# Altium project DAU_Kupplung_3phasig_V1_13.PrjPcb
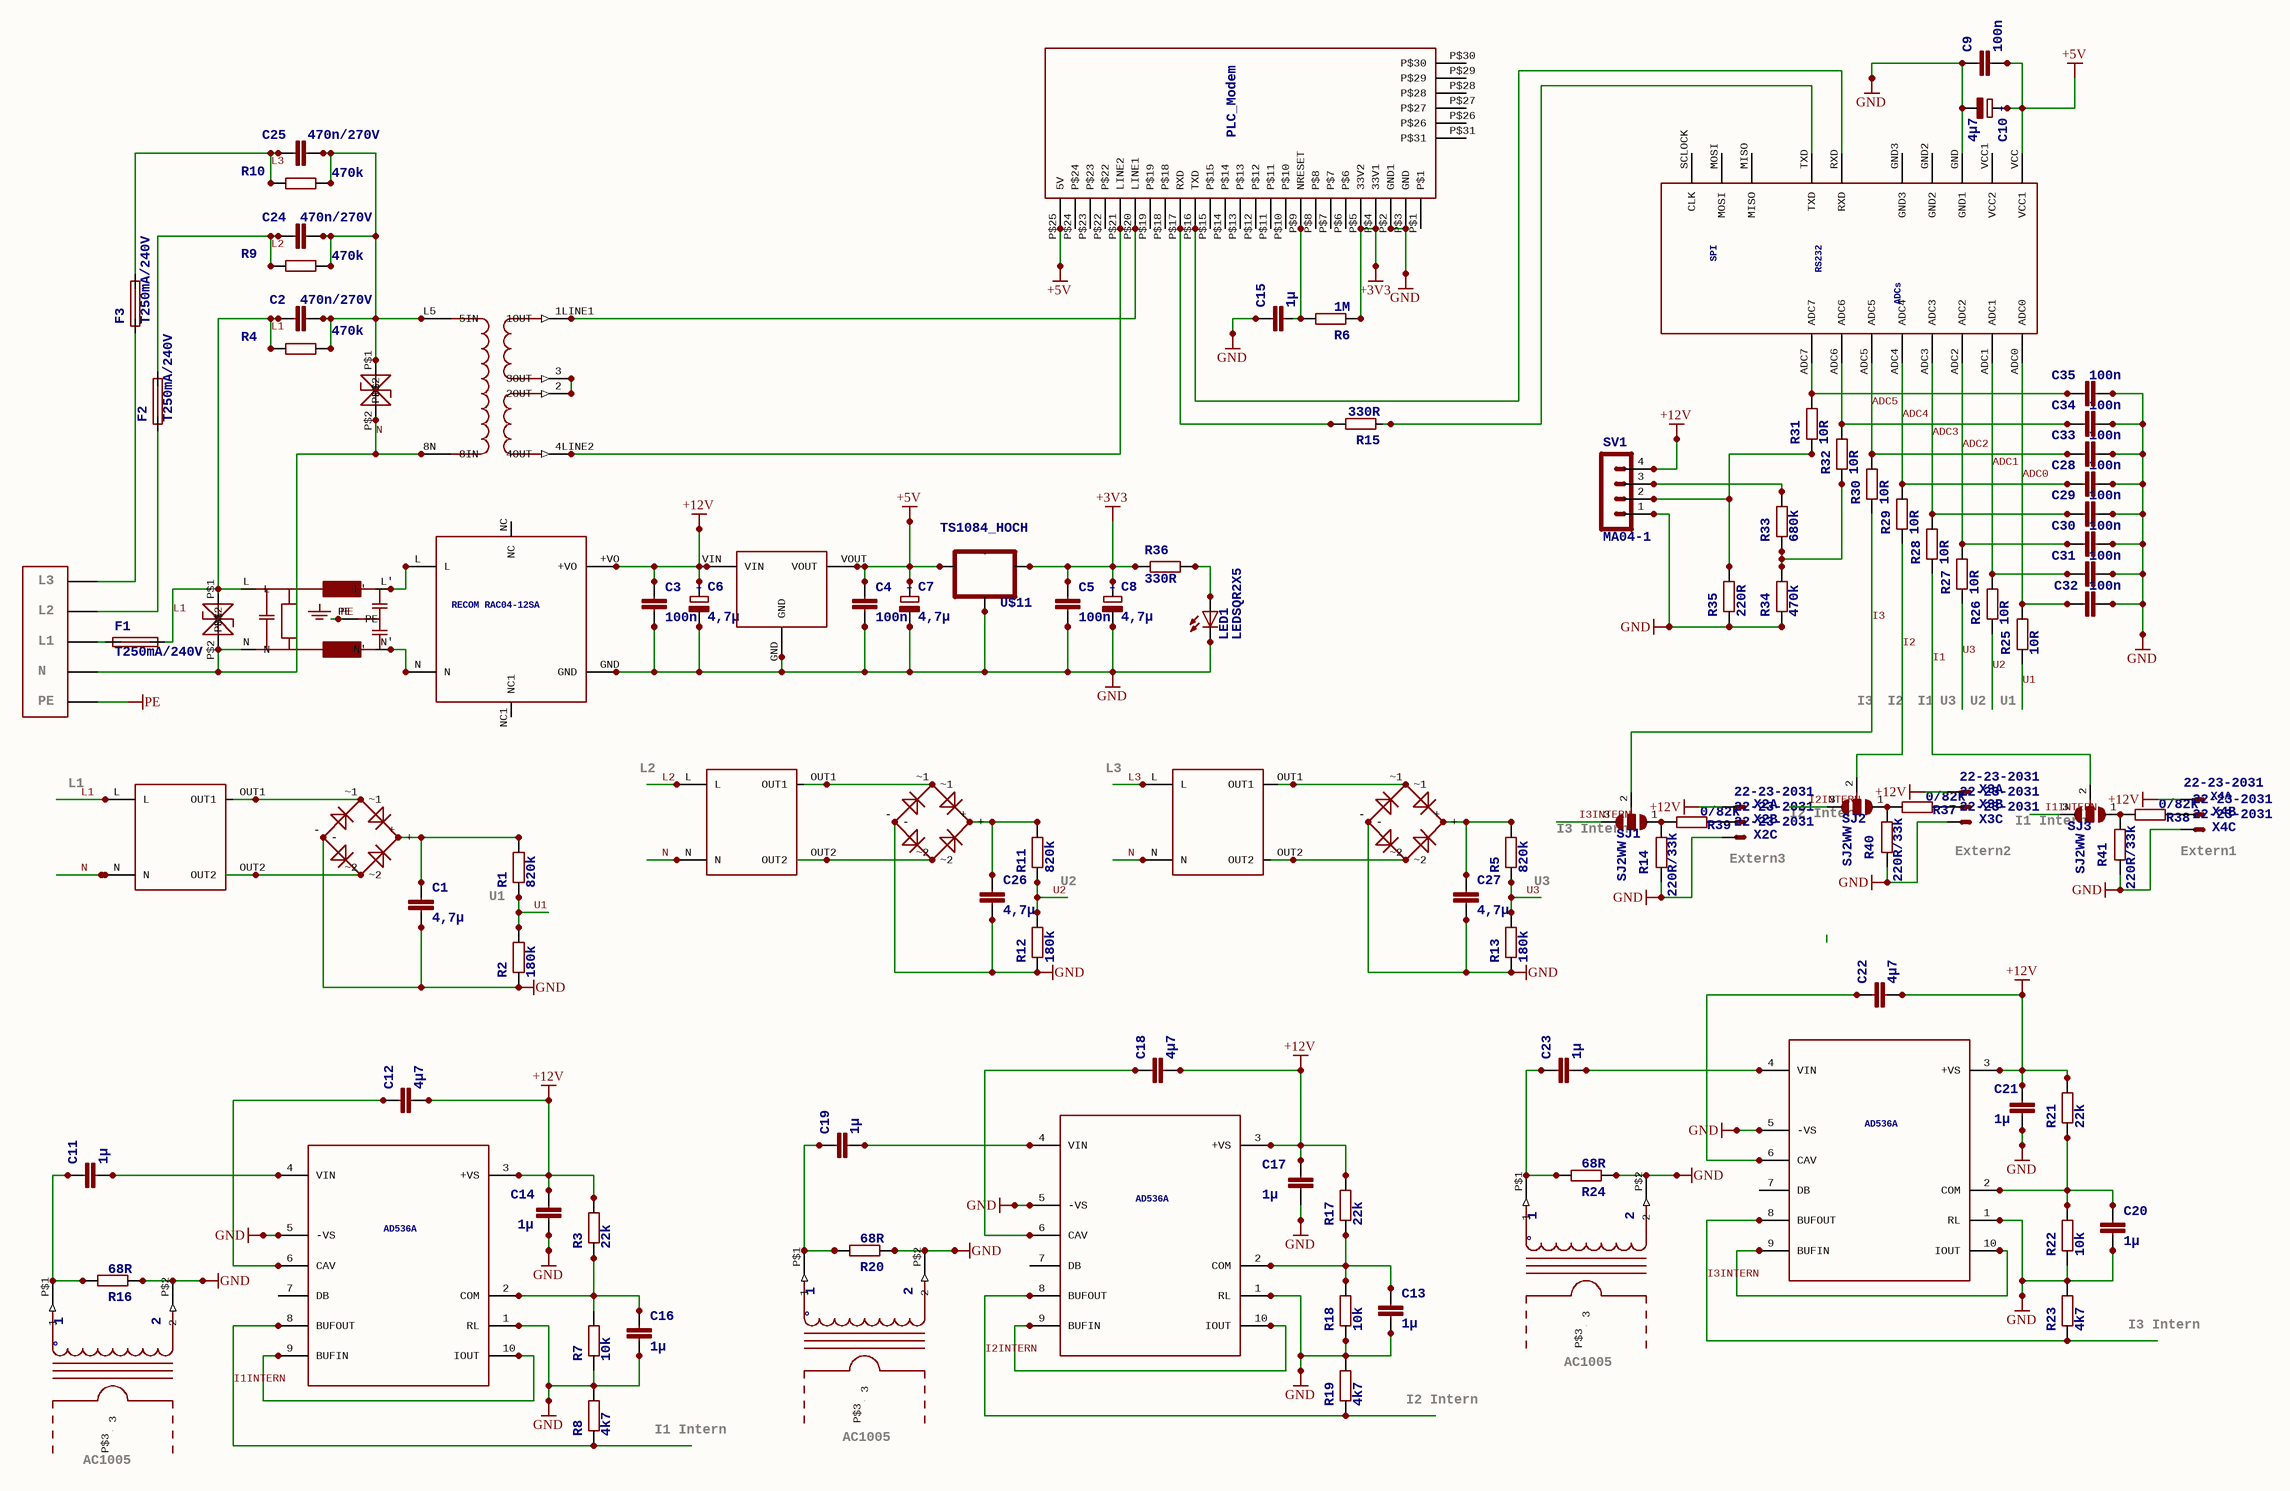
[diagram p0: DAU_Kupplung_3phasig_V1_13.SchDoc]
1 sheet, 109 parts. Net scope: global (net labels, ports and power ports of the same name join across sheets).
Board file: DAU_Kupplung_3phasig_V1_13.PcbDoc

## Sheet DAU_Kupplung_3phasig_V1_13.SchDoc: DAU_Kupplung_3phasig_V1_13.sch
size 410 x 293 mm; Date: 19.11.2014 09:24:20; DocumentNumber: Document Number:; Revision: REV:; SheetNumber: 1

### Parts
AC1002_1  AC1010  [AC1010]  (value not drawn)
C1  4,7µ  [C1206]
C2  470n/270V  [C225-087X268]
C3  100n  [C0805K]
C4  100n  [C0805K]
C5  100n  [C0805K]
C6  4,7µ  [E2,5-6]
C7  4,7µ  [E2,5-6]
C8  4,7µ  [E2,5-6]
C9  100n  [C0805K]
C10  4µ7  [E2,5-6E]
C11  1µ  [C0805K]
C12  4µ7  [C0805K]
C13  1µ  [C0805K]
C14  1µ  [C0805K]
C15  1µ  [C0805K]
C16  1µ  [C0805K]
C17  1µ  [C0805K]
C18  4µ7  [C0805K]
C19  1µ  [C0805K]
C20  1µ  [C0805K]
C21  1µ  [C0805K]
C22  4µ7  [C0805K]
C23  1µ  [C0805K]
C24  470n/270V  [C225-087X268]
C25  470n/270V  [C225-087X268]
C26  4,7µ  [C1206]
C27  4,7µ  [C1206]
C28  100n  [C0805K]
C29  100n  [C0805K]
C30  100n  [C0805K]
C31  100n  [C0805K]
C32  100n  [C0805K]
C33  100n  [C0805K]
C34  100n  [C0805K]
C35  100n  [C0805K]
F1  T250mA/240V  [TR5]
F2  T250mA/240V  [TR5]
F3  T250mA/240V  [TR5]
LED1  LEDSQR2X5  [LED2X5]
P6KE300CA  P6KE300CA  [TSV]  (value not drawn)
R1  820k  [R0805]
R2  180k  [R0805]
R3  22k  [R0805]
R4  470k  [0204/7]
R5  820k  [R0805]
R6  1M  [R0805]
R7  10k  [R0805]
R8  4k7  [R0805]
R9  470k  [0204/7]
R10  470k  [0204/7]
R11  820k  [R0805]
R12  180k  [R0805]
R13  180k  [R0805]
R14  220R/33k  [R0805]
R15  330R  [R0805]
R16  68R  [0204/7]
R17  22k  [R0805]
R18  10k  [R0805]
R19  4k7  [R0805]
R20  68R  [0204/7]
R21  22k  [R0805]
R22  10k  [R0805]
R23  4k7  [R0805]
R24  68R  [0204/7]
R25  10R  [R0805]
R26  10R  [R0805]
R27  10R  [R0805]
R28  10R  [R0805]
R29  10R  [R0805]
R30  10R  [R0805]
R31  10R  [R0805]
R32  10R  [R0805]
R33  680k  [R0805]
R34  470k  [R0805]
R35  220R  [R0805]
R36  330R  [R0805]
R37  0/82k  [R0805]
R38  0/82k  [R0805]
R39  0/82k  [R0805]
R40  220R/33k  [R0805]
R41  220R/33k  [R0805]
SJ1  SJ2WW  [SJ_2W]
SJ2  SJ2WW  [SJ_2W]
SJ3  SJ2WW  [SJ_2W]
SV1  MA04-1  [MA04-1]
TSV2  TSV  [TSV]  (value not drawn)
U$1  RECOM_RAC04_12SA  [RAC04_12SA]  (value not drawn)
U$2  SICHERHEITSTRAFO  [TRAFO_0,35VA]  (value not drawn)
U$3  ADUC831_MINIMUM  [ADUC_MINIMUM]  (value not drawn)
U$4  MODEMSTECKER  [MODEM_FUSS]  (value not drawn)
U$5  PLC_UEBERTRAGER_V2  [PLC-UEBERTRAGER_V2]  (value not drawn)
U$7  AC1010  [AC1010]  (value not drawn)
U$8  RECTIFIER  [RECTIFIER]  (value not drawn)
U$10  RECOM_785_05  [RECOM785X]  (value not drawn)
U$11  TS1084_HOCH  [TS1084_HOCH]
U$12  AD536  [TO100_10PIN]  (value not drawn)
U$13  AD536  [TO100_10PIN]  (value not drawn)
U$14  AC1010  [AC1010]  (value not drawn)
U$15  AD536  [TO100_10PIN]  (value not drawn)
U$16  SICHERHEITSTRAFO  [TRAFO_0,35VA]  (value not drawn)
U$17  RECTIFIER  [RECTIFIER]  (value not drawn)
U$18  SICHERHEITSTRAFO  [TRAFO_0,35VA]  (value not drawn)
U$19  RECTIFIER  [RECTIFIER]  (value not drawn)
U$20  NETZFILTER_05_A  [NETZFILTER]  (value not drawn)
X1  CONNECTO_5_POL  [CONNECTOR_5_POL]  (value not drawn)
X2  22-23-2031  [22-23-2031]  (parts A,B,C of 3)
X3  22-23-2031  [22-23-2031]  (parts A,B,C of 3)
X4  22-23-2031  [22-23-2031]  (parts A,B,C of 3)

### Nets
+3V3: C5.1 C8.+ R6.1 R36.1 U$4.P$4(33V1) U$4.P$5(33V2) U$11.OUT
+5V: C4.1 C7.+ C9.2 C10.+ U$3.VCC(VCC1) U$4.P$25(5V) U$10.VOUT U$11.IN
+12V: C3.1 C6.+ C12.2 C14.2 C17.2 C18.2 C21.1 C22.2 R3.2 R17.2 R21.2 SV1.4 U$1.+VO U$10.VIN U$12.3(+VS) U$13.3(+VS) U$15.3(+VS) X2.1(S) X3.1(S) X4.1(S)
GND: AC1002_1.P$2(2) C1.2 C3.2 C4.2 C5.2 C6.- C7.- C8.- C9.1 C10.- C13.2 C14.1 C15.1 C16.2 C17.1 C20.2 C21.2 C26.2 C27.2 C28.2 C29.2 C30.2 C31.2 C32.2 C33.2 C34.2 C35.2 LED1.K(C) R2.1 R7.1 R8.2 R12.1 R13.1 R14.1 R16.1 R18.1 R19.2 R20.1 R22.1 R23.2 R24.1 R34.1 R35.1 R40.1 R41.1 SV1.1 U$1.GND U$3.GND(GND1) U$4.P$2(GND1) U$4.P$3(GND) U$7.P$2(2) U$8.- U$10.GND U$11.GND U$12.1(RL) U$12.5(-VS) U$13.1(RL) U$13.5(-VS) U$14.P$2(2) U$15.1(RL) U$15.5(-VS) U$17.- U$19.- X2.3(S) X3.3(S) X4.3(S)
PE: U$20.PE X1.P$5
ADC0: C32.1 R25.2 U$3.ADC0
ADC1: C31.1 R26.2 U$3.ADC1
ADC2: C30.1 R27.2 U$3.ADC2
ADC3: C29.1 R28.2 U$3.ADC3
ADC4: C28.1 R29.2 U$3.ADC4
ADC5: C33.1 R30.2 U$3.ADC5
I1: R28.1 SJ3.2
I1INTERN: R8.1 SJ3.3 U$13.8(BUFOUT)
I2: R29.1 SJ2.2
I2INTERN: R19.1 SJ2.3 U$12.8(BUFOUT)
I3: R30.1 SJ1.2
I3INTERN: R23.1 SJ1.3 U$15.8(BUFOUT)
L1: C2.1 F1.2 P6KE300CA.P$1 R4.2 U$2.L U$20.L
L2: C24.1 F2.2 R9.2 U$16.L
L3: C25.1 F3.2 R10.2 U$18.L
N: P6KE300CA.P$2 TSV2.P$2 U$2.N U$5.8N(8IN) U$16.N U$18.N U$20.N X1.P$4
U1: R1.1 R2.2 R25.1
U2: R11.1 R12.2 R26.1
U3: R5.1 R13.2 R27.1
NetAC1002_1_P$1: AC1002_1.P$1(1) C11.1 R16.2
NetC1_1: C1.1 R1.2 U$8.+
NetC2_2: C2.2 C24.2 C25.2 R4.1 R9.1 R10.1 TSV2.P$1 U$5.L5(5IN)
NetC11_2: C11.2 U$13.4(VIN)
NetC12_1: C12.1 U$13.6(CAV)
NetC13_1: C13.1 R17.1 R18.2 U$12.2(COM)
NetC15_2: C15.2 R6.2 U$4.P$9(NRESET)
NetC16_1: C16.1 R3.1 R7.2 U$13.2(COM)
NetC18_1: C18.1 U$12.6(CAV)
NetC19_1: C19.1 R20.2 U$7.P$1(1)
NetC19_2: C19.2 U$12.4(VIN)
NetC20_1: C20.1 R21.1 R22.2 U$15.2(COM)
NetC22_1: C22.1 U$15.6(CAV)
NetC23_1: C23.1 R24.2 U$14.P$1(1)
NetC23_2: C23.2 U$15.4(VIN)
NetC26_1: C26.1 R11.2 U$17.+
NetC27_1: C27.1 R5.2 U$19.+
NetC34_1: C34.1 R32.2 U$3.ADC6
NetC35_1: C35.1 R31.2 U$3.ADC7
NetF1_1: F1.1 X1.P$3
NetF2_1: F2.1 X1.P$2
NetF3_1: F3.1 X1.P$1
NetLED1_A: LED1.A R36.2
NetR14_2: R14.2 R39.2 SJ1.1
NetR15_1: R15.1 U$3.TXD
NetR15_2: R15.2 U$4.P$17(RXD)
NetR31_1: R31.1 R35.2 SV1.2
NetR32_1: R32.1 R33.1 R34.2
NetR33_2: R33.2 SV1.3
NetR37_1: R37.1 X3.2(S)
NetR37_2: R37.2 R40.2 SJ2.1
NetR38_1: R38.1 X4.2(S)
NetR38_2: R38.2 R41.2 SJ3.1
NetR39_1: R39.1 X2.2(S)
NetU$1_L: U$1.L U$20.L'
NetU$1_N: U$1.N U$20.N'
NetU$2_OUT1: U$2.OUT1 U$8.~1
NetU$2_OUT2: U$2.OUT2 U$8.~2
NetU$3_RXD: U$3.RXD U$4.P$16(TXD)
NetU$4_P$20: U$4.P$20(LINE1) U$5.1LINE1(1OUT)
NetU$4_P$21: U$4.P$21(LINE2) U$5.4LINE2(4OUT)
NetU$5_2: U$5.2(2OUT) U$5.3(3OUT)
NetU$12_9: U$12.9(BUFIN) U$12.10(IOUT)
NetU$13_9: U$13.9(BUFIN) U$13.10(IOUT)
NetU$15_9: U$15.9(BUFIN) U$15.10(IOUT)
NetU$16_OUT1: U$16.OUT1 U$17.~1
NetU$16_OUT2: U$16.OUT2 U$17.~2
NetU$18_OUT1: U$18.OUT1 U$19.~1
NetU$18_OUT2: U$18.OUT2 U$19.~2

Not connected (* = marked no-connect by the designer): AC1002_1 P$3(3); U$1 NC NC1; U$3 GND2 GND3 MISO MOSI SCLOCK(CLK) VCC1(VCC2); U$4 P$1 P$6 P$7 P$8 P$10 P$11 P$12 P$13 P$14 P$15 P$18 P$19 P$22 P$23 P$24 P$26 P$27 P$28 P$29 P$30 P$31; U$7 P$3(3); U$12 7(DB); U$13 7(DB); U$14 P$3(3); U$15 7(DB)

### Notes on the sheet
- (near X1) L3
- (near X1) N
- (near X1) L1
- (near X1) L2
- (near X1) PE
- I3
- I2
- I1
- U3
- U2
- (near R25) U1
- L1
- L2
- (near U$18) L3
- (near SJ2) I2 Intern
- (near SJ3) I1 Intern
- (near R1) U1
- (near R11) U2
- (near R5) U3
- (near SJ1) I3 Intern
- (near X2) Extern3
- (near X3) Extern2
- (near X4) Extern1
- I3 Intern
- I2 Intern
- (near U$14) AC1005
- (near AC1002_1) AC1005
- I1 Intern
- (near U$7) AC1005

### Library data of the parts
C1 C26 C27 = C-EUC1206: <B>CAPACITOR</B>, European symbol
C2 C24 C25 = C-EU225-087X268: <B>CAPACITOR</B>, European symbol
C3-C5 C9 C11-C23 C28-C35 = C-EUC0805K: <B>CAPACITOR</B>, European symbol
C6-C8 = CPOL-EUE2.5-6: <B>POLARIZED CAPACITOR</B>, European symbol; +: +
C10 = CPOL-EUE2,5-6E: <B>POLARIZED CAPACITOR</B>, European symbol; +: +
F1-F3 = TR5: <b>FUSE</b><p> / Wickmann; OC_FARNELL: unknown; OC_NEWARK: unknown
LED1 = LEDSQR2X5: <b>LED</b><p> / <u>OSRAM</u>:<br> / - <u>CHIPLED</u><br> / LG R971, LG N971, LY N971, LG Q971, LY Q971, LO R971, LY R971 / LH N974, LH R974<br> / LS Q976, LO Q976, LY Q976<br> / LO Q996<br> / - <u>Hyper CHIPLED</u><br> / LW Q18S<br> / LB Q993, LB Q99A, LB R99A<br> / - <u>SideLED</u><br> / LS A670, LO A670, LY A670, LG A670, LP A670<br> / LB A673, LV A673, LT A673, LW A673<br> / LH A674<br> / LY A675<br> / LS A676, LA A676, LO A676, LY A676, LW A676<br> / LS A679, LY A679, LG A679<br> / -  <u>Hyper Micro SIDELED®</u><br> / LS Y876, LA Y876, LO Y876, LY Y876<br> / LT Y87S<br> / - <u>SmartLED</u><br> / LW L88C, LW L88S<br> / LB L89C, LB L89S, LG L890<br> / LS L89K, LO L89K, LY L89K<br> / LS L896, LA L896, LO L896, LY L896<br> / - <u>TOPLED</u><br> / LS T670, LO T670, LY T670, LG T670, LP T670<br> / LSG T670, LSP T670, LSY T670, LOP T670, LYG T670<br> / LG T671, LOG T671, LSG T671<br> / LB T673, LV T673, LT T673, LW T673<br> / LH T674<br> / LS T676, LA T676, LO T676, LY T676, LB T676, LH T676, LSB T676, LW T676<br> / LB T67C, LV T67C, LT T67C, LS T67K, LO T67K, LY T67K, LW E67C<br> / LS E67B, LA E67B, LO E67B, LY E67B, LB E67C, LV E67C, LT E67C<br> / LW T67C<br> / LS T679, LY T679, LG T679<br> / LS T770, LO T770, LY T770, LG T770, LP T770<br> / LB T773, LV T773, LT T773, LW T773<br> / LH T774<br> / LS E675, LA E675, LY E675, LS T675<br> / LS T776, LA T776, LO T776, LY T776, LB T776<br> / LHGB T686<br> / LT T68C, LB T68C<br> / - <u>Hyper Mini TOPLED®</u><br> / LB M676<br> / - <u>Mini TOPLED Santana®</u><br> / LG M470<br> / LS M47K, LO M47K, LY M47K / <p> / Source: http://www.osram.convergy.de<p> / <u>LUXEON:</u><br> / - <u>LUMILED®</u><br> / LXK2-PW12-R00, LXK2-PW12-S00, LXK2-PW14-U00, LXK2-PW14-V00<br> / LXK2-PM12-R00, LXK2-PM12-S00, LXK2-PM14-U00<br> / LXK2-PE12-Q00, LXK2-PE12-R00, LXK2-PE12-S00, LXK2-PE14-T00, LXK2-PE14-U00<br> / LXK2-PB12-K00, LXK2-PB12-L00, LXK2-PB12-M00, LXK2-PB14-N00, LXK2-PB14-P00, LXK2-PB14-Q00<br> / LXK2-PR12-L00, LXK2-PR12-M00, LXK2-PR14-Q00, LXK2-PR14-R00<br> / LXK2-PD12-Q00, LXK2-PD12-R00, LXK2-PD12-S00<br> / LXK2-PH12-R00, LXK2-PH12-S00<br> / LXK2-PL12-P00, LXK2-PL12-Q00, LXK2-PL12-R00 / <p> / Source: www.luxeon.com<p> / <u>KINGBRIGHT:</U><p> / KA-3528ASYC<br> / Source: www.kingbright.com
P6KE300CA = TSV
R1-R3 R5-R8 R11-R15 R17-R19 R21-R23 R25-R41 = R-EU_R0805: <B>RESISTOR</B>, European symbol
R4 R9 R10 R16 R20 R24 = R-EU_0204/7: <B>RESISTOR</B>, European symbol
SJ1-SJ3 = SJ2WW: SMD solder <b>JUMPER</b>
SV1 = MA04-1: <b>PIN HEADER</b>; OC_FARNELL: unknown; OC_NEWARK: unknown
X2-X4 = 22-23-2031: .100" (2.54mm) Center Header - 3 Pin; MF: MOLEX; MPN: 22-23-2031; OC_FARNELL: 1462950; OC_NEWARK: 30C0862
AC1002_1 U$7 U$14 = AC1010: °: °; 1: 1; 2: 2
U$1 = RECOM_RAC04_12SA: RECOM RAC04-12SA: RECOM RAC04-12SA
U$3 = ADUC831_MINIMUM: SPI: SPI; RS232: RS232; ADCs: ADCs
U$4 = MODEMSTECKER: PLC_Modem: PLC_Modem
U$12 U$13 U$15 = AD536: AD536A: AD536A